# EAGLE design LEDShoeslaces (EAGLE 8.3.0)
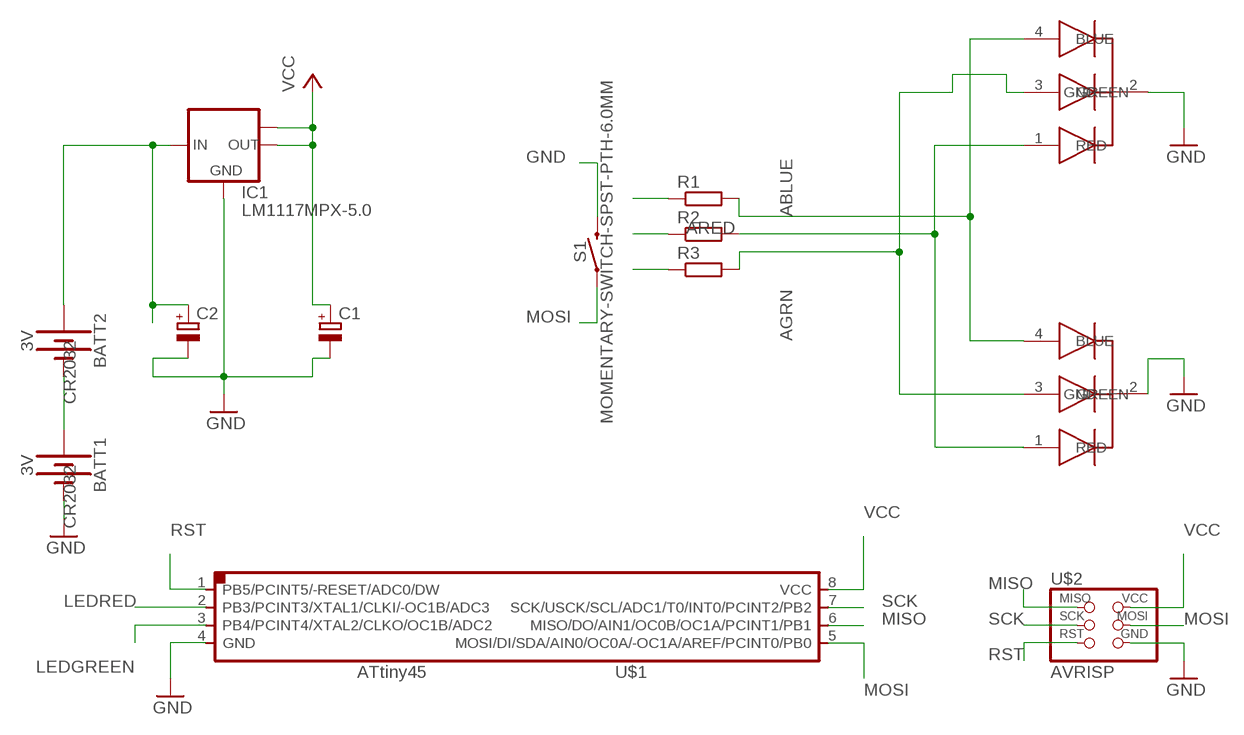
[diagram p0: schematic, sheet 1]

## Parts
BATT1  3V  BATTERY-20MM_SMD  [BATTCON_20MM]
BATT2  3V  BATTERY-20MM_SMD  [BATTCON_20MM]
C1  CPOL-EUCT7343  [CT7343]
C2  CPOL-EUCT7343  [CT7343]
IC1  LM1117MPX-5.0  [SOT223]
R1  R-EU_R1206  [R1206]
R2  R-EU_R1206  [R1206]
R3  R-EU_R1206  [R1206]
S1  MOMENTARY-SWITCH-SPST-PTH-6.0MM  [TACTILE_SWITCH_PTH_6.0MM]
U$1  ATTINY45SI  [SOIC8]
U$2  AVRISP  [2X03]
U$3  LEDRGB  [LEDRGB]
U$4  LEDRGB  [LEDRGB]

## Nets
ABLUE: R1.2 U$3.4(BLUE) U$4.4(BLUE)
AGRN: R3.2 U$3.3(GREEN) U$4.3(GREEN)
ARED: R2.2 U$3.1(RED) U$4.1(RED)
BATS: BATT1.1(+) BATT2.2(-)
GND: BATT1.2(-) C1.- C2.- IC1.1(GND) S1.3 U$1.4(GND) U$2.6(GND) U$3.2(GND) U$4.2(GND)
LEDGREEN: R3.1 U$1.3(PB4/PCINT4/XTAL2/CLKO/OC1B/ADC2)
LEDRED: R1.1 U$1.2(PB3/PCINT3/XTAL1/CLKI/-OC1B/ADC3)
MISO: R2.1 U$1.6(MISO/DO/AIN1/OC0B/OC1A/PCINT1/PB1) U$2.1(MISO)
MOSI: S1.1 U$1.5(MOSI/DI/SDA/AIN0/OC0A/-OC1A/AREF/PCINT0/PB0) U$2.4(MOSI)
RST: U$1.1(PB5/PCINT5/-RESET/ADC0/DW) U$2.5(RST)
SCK: U$1.7(SCK/USCK/SCL/ADC1/T0/INT0/PCINT2/PB2) U$2.3(SCK)
V_BATT: BATT2.1(+) C2.+ IC1.3(IN)
VCC: C1.+ IC1.2(OUT) IC1.TAB(OUT1) U$1.8(VCC) U$2.2(VCC)

## Library data of the parts
BATT1 BATT2 = SparkFun-Batteries:BATTERY: Battery - Single Cell A variety of battery chemistries, sizes, and footprints. Device List: 20MM_PTH - Coin Cell Battery Holder - 20mm (PTH) <https://www.sparkfun.com/products/783> 6.8MM_PTH - Coin Cell Battery Holder - 6.8MM(SMD) <https://www.digikey.com/product-detail/en/seiko-instruments/MS621FE-FL11E/728-1057-ND/1889208?WT.srch=1&gclid=CNOQ5a6LzdQCFZS2wAodXCkE0g> 12MM_SMD - Coin Cell Battery Holder - 12mm (SMD) <https://www.sparkfun.com/products/10592> 12MM_PTH - Coin Cell Battery Holder - 12mm (PTH) <https://www.sparkfun.com/products/7948> 20MM_SMD - 20mm Coin Cell Battery Holder (SMD) (2 legs) Used on the Big Time Watch Kit <https://www.sparkfun.com/products/11734> 20MM_SMD_4LEGS - Coin Cell Battery Holder - 20mm (SMD) <https://www.sparkfun.com/products/11892> 20MM_SMD_4LEGS_OVERPASTE - Coin Cell Battery Holder - 20mm (SMD) <https://www.sparkfun.com/products/11892> (Over-paste on the legs) 24.5MM_PTH - Coin Cell Battery Holder - 24.5mm (PTH) <https://www.sparkfun.com/products/8863> 9V - 9V Battery Holder - PC Mount Used on the SparkFun SparkPunk Sound Kit <https://www.sparkfun.com/products/11177> and SparkFun SparkPunk Sequencer Kit <https://www.sparkfun.com/products/12707> 18650 - Battery Holder - 18650 (PTH) <https://www.sparkfun.com/products/13113> AA - Battery Holder - 1xAA (PTH) <https://www.sparkfun.com/products/7949> AAA - Battery Holder - 1xAAA (PTH) <https://www.sparkfun.com/products/12718> AA_KIT - Battery Holder - 1xAA (PTH) <https://www.sparkfun.com/products/7949> Special kit package - pads only have exposed copper on one side of the board. AAA_KIT - Battery Holder - 1xAAA (PTH) <https://www.sparkfun.com/products/12718> Special kit package - pads only have exposed copper on one side of the board.; PROD_ID: CR2032
C1 C2 = rcl:CPOL-EU: POLARIZED CAPACITOR, European symbol
IC1 = lm1117:LM1117MPX-*
R1-R3 = rcl:R-EU_: RESISTOR, European symbol
S1 = SparkFun-Switches:MOMENTARY-SWITCH-SPST: Momentary Switch (Pushbutton) - SPST Normally-open (NO) SPST momentary switches (buttons, pushbuttons). Variants PTH-12MM - 12mm square, through-hole Momentary Pushbutton Switch - 12mm Square <https://www.sparkfun.com/products/9190> (COM-09190) PTH-6.0MM, PTH-6.0MM-KIT - 6.0mm square, through-hole Mini Pushbutton Switch <https://www.sparkfun.com/products/97> (COM-00097) KIT package intended for soldering kit's - only one side of pads' copper is exposed. PTH-RIGHT-ANGLE-KIT - Right-angle, through-hole Right Angle Tactile Button <https://www.sparkfun.com/products/10791> - Used on SparkFun BigTime Watch Kit <https://www.sparkfun.com/products/11734> SMD-12MM - 12mm square, surface-mount Tactile Button - SMD (12mm) <https://www.sparkfun.com/products/12993> (COM-12993) Used on SparkFun PicoBoard <https://www.sparkfun.com/products/11888> SMD-4.5MM - 4.5mm Square Trackball Switch Used on SparkFun Blackberry Trackballer Breakout <https://www.sparkfun.com/products/13169> SMD-4.6MMX2.8MM - 4.60mm x 2.80mm, surface mount Used on SparkFun SAMD21 Mini Breakout <https://www.sparkfun.com/products/13664> SMD-5.2MM, SMD-5.2-REDUNDANT - 5.2mm square, surface-mount Mini Pushbutton Switch - SMD <https://www.sparkfun.com/products/8720> (COM-08720) Used on Arduino Pro Mini <https://www.sparkfun.com/products/11114> REDUNDANT package connects both switch circuits together SMD-6.0X3.5MM - 6.0 x 3.5mm, surface mount Momentary Reset Switch SMD <https://www.sparkfun.com/products/8229> (COM-08229) SMD-6.2MM-TALL - 6.2mm square, surface mount Tactile Button - SMD (6mm) <https://www.sparkfun.com/products/12992> Used on SparkFun Digital Sandbox <https://www.sparkfun.com/products/12651> SMD-RIGHT-ANGLE - Right-angle, surface mount Used on SparkFun Block for Intel® Edison - Arduino <https://www.sparkfun.com/products/13036>; PROD_ID: SWCH-08441; SF_SKU: COM-00097
U$1 = fab:ATTINY45
U$2 = fab:AVRISP
U$3 U$4 = fab:LEDRGB

## Board
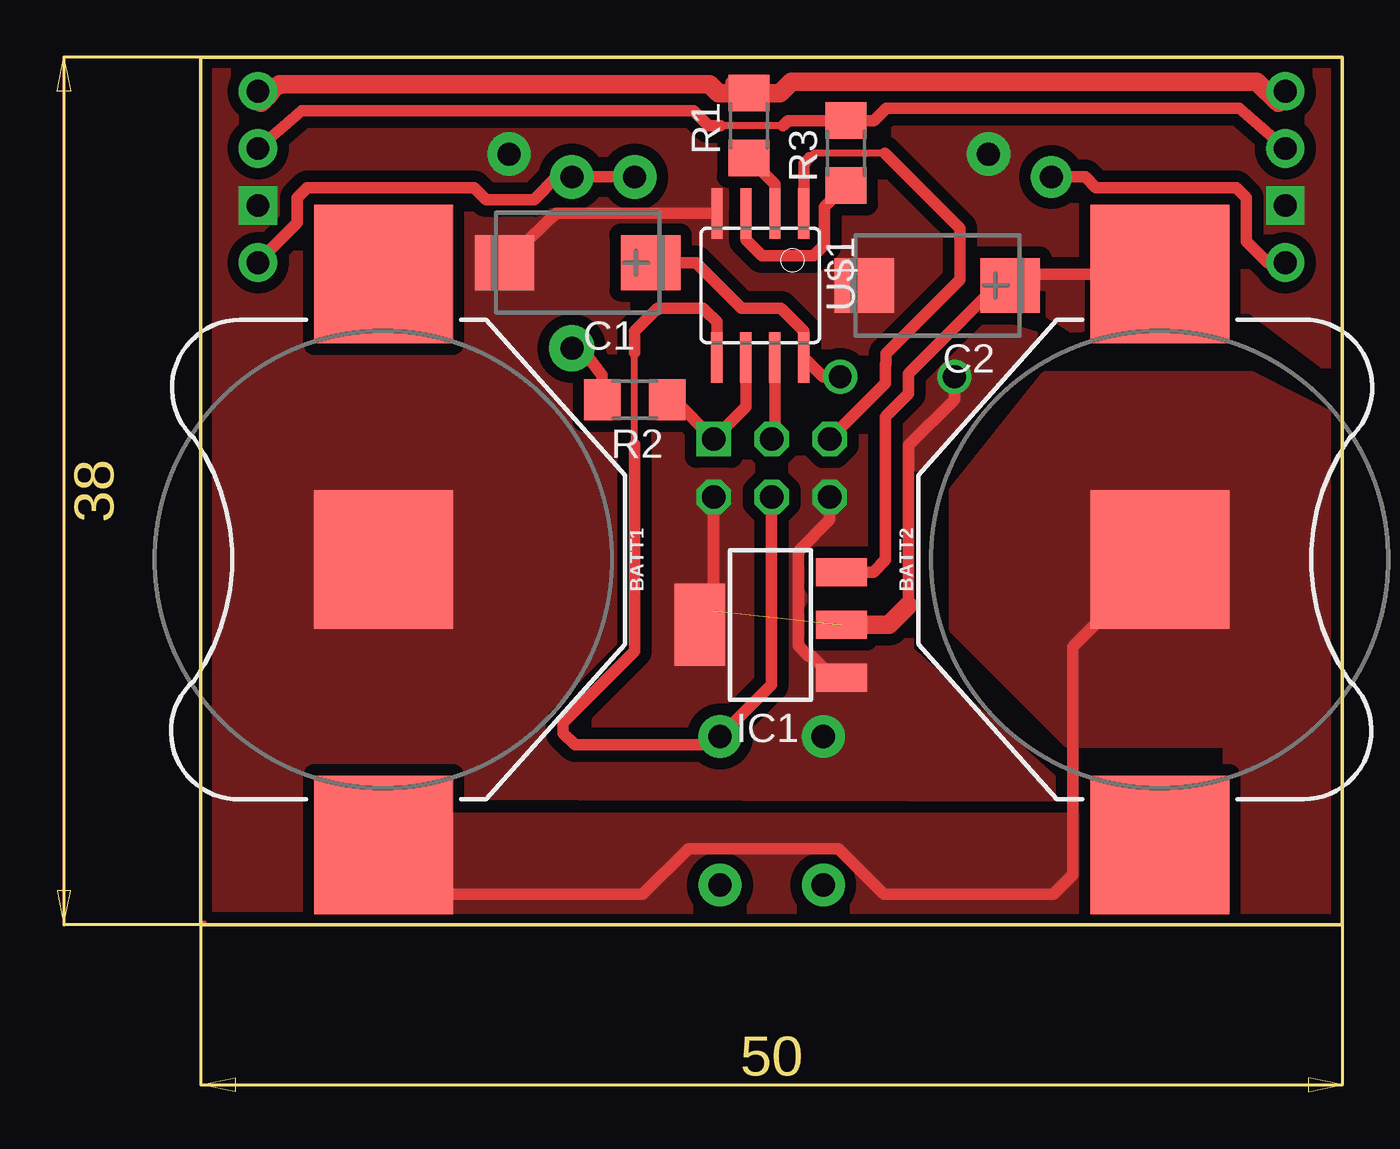
[diagram p1: board, top side]
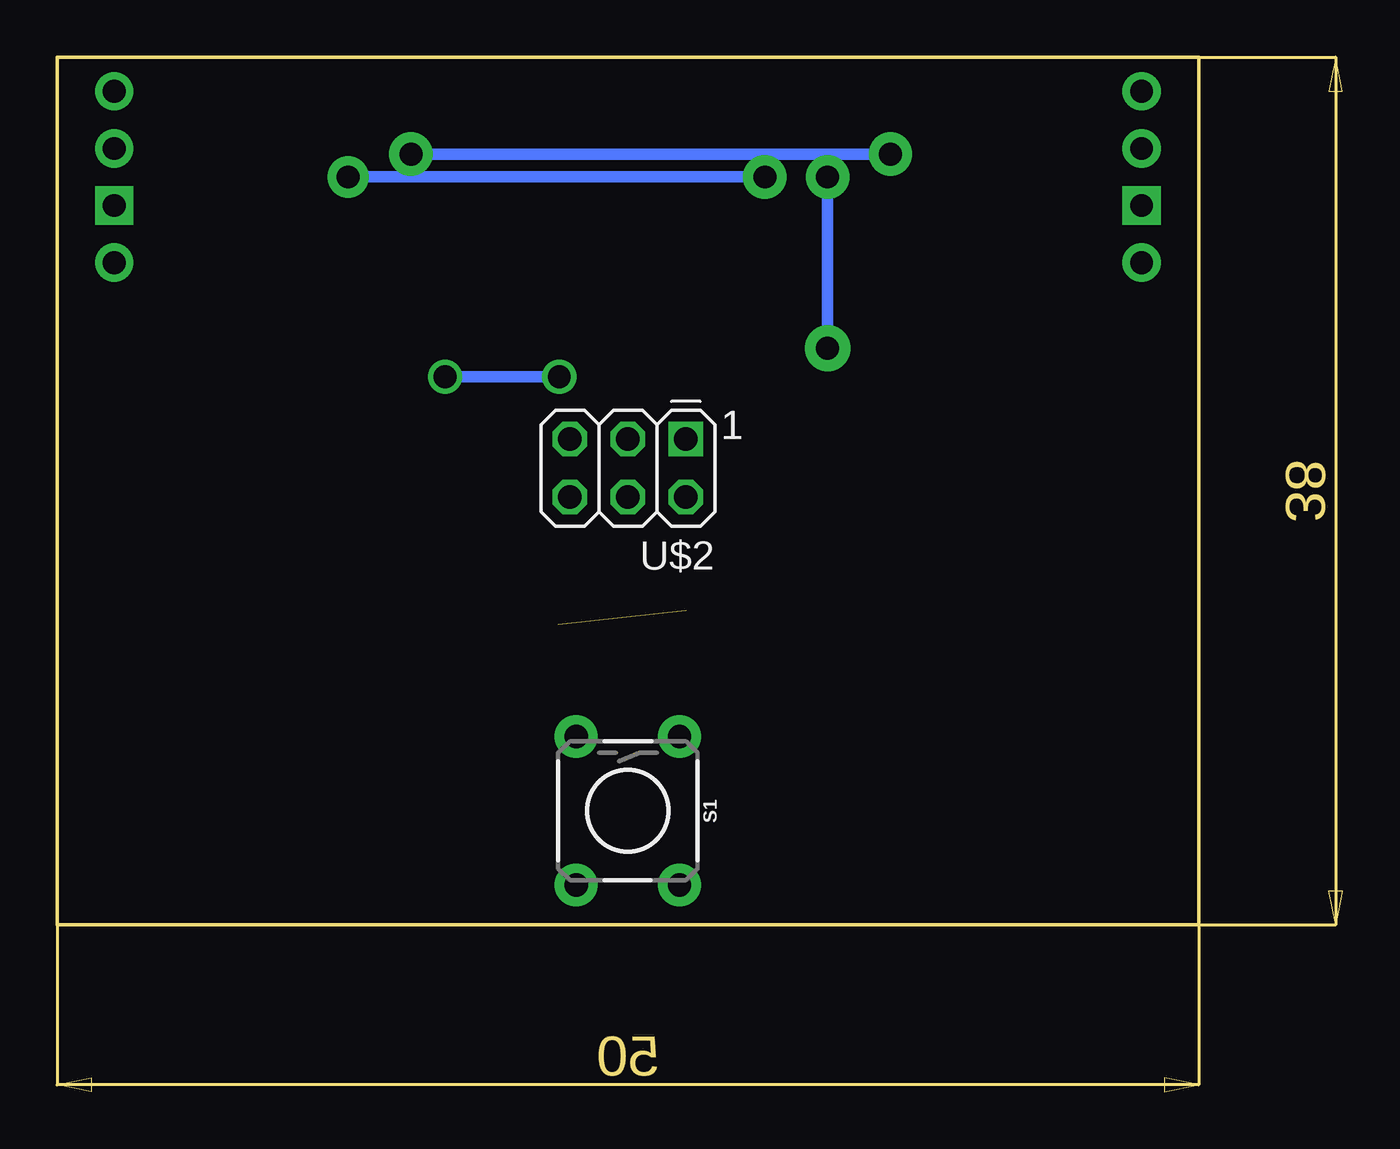
[diagram p2: board, bottom side, seen from below]

Size 50 x 38 mm. Coordinates in mm from the lower left corner, seen from the top.
Outline: 0,0 50,0 50,38 0,38 0,0
Copper layers (1*16): Top 0.035mm / dielectric 1.5mm / Bottom 0.035mm
Design rules "default *": minimum track width 6mil, minimum drill 0.35mm, track to track 0.5mm, track to pad 0.5mm, pad to pad 0.5mm, via to via 0.5mm, smd to smd 0.5mm, copper to edge 0.4mm, drill to drill 0.4mm, minimum pad ring 10mil, minimum via ring 8mil, stop-mask expansion 0.4mm, vias tented up to drill 0mil, thermal gap 10mil

### Footprints (pad centres in the part's own frame; a part is rotated, then mirrored left to right if it is on the bottom)
BATTCON_20MM = smd 6.07 x 6.07: 1 -12.5,0; 2 0,0; 3 12.5,0
CT7343 = smd 2.6 x 2.4: + -3.2,0; - 3.2,0
SOT223 = smd 1.219 x 2.235: 1 -2.311,-3.099; 2 0,-3.099; 3 2.311,-3.099 | smd 3.6 x 2.2: TAB 0,3.099
R1206 = smd 1.6 x 1.803: 1 -1.422,0; 2 1.422,0
TACTILE_SWITCH_PTH_6.0MM = drill 1.016 pad 1.88: 1 -3.251,2.261; 2 3.251,2.261; 3 -3.251,-2.261; 4 3.251,-2.261
SOIC8 = smd 0.5 x 2.2: 1 -1.905,-3.154; 2 -0.645,-3.154; 3 0.625,-3.154; 4 1.895,-3.154; 5 1.905,3.154; 6 0.635,3.154; 7 -0.635,3.154; 8 -1.905,3.154
2X03 = drill 1.016 square: 1 -2.54,-1.27 | drill 1.016 octagon: 2 -2.54,1.27; 3 0,-1.27; 4 0,1.27; 5 2.54,-1.27; 6 2.54,1.27
LEDRGB = drill 1 pad 1.676: 1 -4,0; 3 1,0; 4 3.5,0 | drill 1 pad 1.676 square: 2 -1.5,0

### Placement (x,y rotation side)
BATT1  8,16 90 top
BATT2  42,16 270 top
C1  16.5,29 180 top
C2  32.25,28 180 top
IC1  24.95,13.14 90 top
R1  24,35 90 top
R2  19,23 180 top
R3  28.25,33.8 90 top
S1  25,5 270 bottom
U$1  24.5,28 180 top
U$2  25,20.01 180 bottom
U$3  2.5,33 90 top
U$4  47.5,33 90 top

### Tracks (layer width: path | path; a pad name or v marks a point on that pad's centre or on a via)
ABLUE
  Top 0.508: 23.22,36.9 R1.2 23.96,36.91
  Top 0.813: U$4.4 47.18,36 46.25,36.93 25.87,36.93 25.37,36.42 R1.2 22.67,36.42 22.28,36.81 3.46,36.81 3.38,36.74 3.28,36.72 3.01,36.36 2.64,36 U$3.4
AGRN
  Top 0.305: 25.5,35 22.75,35
  Top 0.508: 25.5,35 25.72,35.22 R3.2 29.47,35.22 30.02,35.77 45.48,35.77 U$4.3 | 22.75,35 22.24,35 21.59,35.65 4.4,35.65 U$3.3
ARED  (via drill 1 pad 1.8, 1 pad 1.9, 1 pad 2)
  Top 0.508: v19,32.75 v16.25,32.75 15.58,32.75 14.58,31.75 12.5,31.75 11.96,32.29 4.65,32.29 4.21,31.85 4.21,30.75 2.47,29 U$3.1 | v16.25,25.25 16.33,25.72 17.58,24.06 R2.2 | v37.25,32.75 38.75,32.75 39.21,32.29 45.35,32.29 45.79,31.85 45.79,29.94 46.73,29 U$4.1
  Bottom 0.508: v16.25,32.75 v16.25,25.25 | v19,32.75 v37.25,32.75
BATS
  Top 0.508: 10.97,1.35 19.35,1.35 21.35,3.35 27.92,3.35 29.92,1.35 37.35,1.35 38.19,2.19 38.19,12.19 BATT2.2 | 10.97,1.35 10.65,1.35 | BATT1.1 8.82,3.5 10.97,1.35
  pour Top (no thermals): 37,24 46,24 50,22 50,0 45,0 45,8 38,8 33,13 33,19
  pour Top (no thermals): 10.63,4.68 39.16,4.68 39.37,3.56 39.37,-0.07 39.18,-0.27 11.11,-0.27 10.62,0.23 10.62,3.65 10.68,3.71
GND  (via drill 1 pad 1.9)
  Top 0.508: IC1.1 27.71,10.83 26.76,11.78 26.62,11.78 26.18,12.22 26.18,16.37 27.54,17.74 U$2.6 | U$1.4 15.55,31.15 C1.-
  Bottom 0.508: v13.5,33.75 v34.5,33.75
  pour Top (no thermals): 0,38 50,38 50,24 46,27 37,27 31,20 31,12 38.09,5.63 9.37,5.73 5.25,0 0,0
LEDGREEN
  Top 0.508: R3.1 27.31,31.44 27.31,29.79 26.82,29.3 24.58,29.3 23.88,30.01 U$1.3
LEDRED
  Top 0.508: U$1.2 25.14,32.43 R1.1
MISO
  Top 0.508: U$1.6 23.86,22.68 U$2.1 20.74,23 R2.1
MOSI
  Top 0.305: 19,21.04 19,25.06
  Top 0.508: 19,25.06 19,26 20,27 22,27 22.1,26.9 22.59,26.4 U$1.5 | 19,21.04 19,11.99 15.87,8.86 15.87,8.39 16.38,7.88 22.37,7.88 S1.1 23.79,9.31 25,10.52 U$2.4
RST
  Top 0.305: 29.15,33.78 29,33.78 | 29.96,33.78 29.15,33.78 | 29,33.78 29.15,33.78 | 26.66,33.59 26.85,33.78 29,33.78
  Top 0.508: 27.54,21.54 U$2.5 29.99,23.73 29.99,24.55 30,24.56 30,25 33.25,28.25 33.25,30.5 29.96,33.78 | U$1.1 26.41,33.34 26.66,33.59
SCK
  Top 0.508: U$1.7 25.14,21.41 U$2.3
V_BATT
  Top 0.508: 27.19,15.81 27.55,15.45 IC1.3 29.45,15.45 29.99,15.99 29.99,22.25 31,23.25 31,24.13 35.27,28.4 C2.+ 36.1,28.5 BATT2.1 41.67,29
  pour Top: 34.55,28.43 38.24,26.13 43.31,27.41 42.42,28.61
VCC  (via drill 1)  (1 unrouted)
  Top 0.508: U$2.2 22.46,13.75 IC1.TAB | v33,24 33,23 31,21 31,14 | C1.+ 21.68,29 23.68,27 25.4,27 26.41,25.99 U$1.8 27.25,24 v28,24
  Top 0.813: IC1.2 30.14,13.14 31,14
  Bottom 0.508: v33,24 v28,24
  pour Top (no thermals): 19.1,21.62 21.98,21.62 22.62,20.98 24.09,21.23 24.13,21.2 24.14,21.2 25.6,19.73 25.6,16.02 25.18,15.61 25.18,11.93 25.86,11.26 26.35,11.26 26.16,11.06 26.16,9.46 25.18,8.47 25.18,8.22 21.73,7.84 15.27,7.84 15.12,8 15.12,8.26 18.88,12.02 18.88,21.41 19.07,21.6 19.07,21.64 19.08,21.66
  pour Top: 31.75,24 31.5,22.75 30.5,22 31.25,20 36.5,25.75 34,26.5
(copper drawn outside any net)
  shapes: Top area x967

### Text on the board
Top: numerik games 2017 | /home/ioknox/eagle/LEDShoeslaces/A3O5PRO100002-IMG170822 Logo v2.2 300dpi 8Bits squared.bmp | /home/ioknox/eagle/LEDShoeslaces/A3O5PRO100002-IMG170822 Logo v2.2 300dpi 8Bits squared.bmp | /ws/ng2017/assets/img/logo-600x600.bmp
Route2: /home/ioknox/eagle/LEDShoeslaces/A3O5PRO100002-IMG170822 Logo v2.2 300dpi 8Bits squared.bmp